# EasyEDA schematic Water Tank V6.1_2020-12-28_12-10-16.json

## Sheets
1 Reciver: TITLE: Reciver; REV: 1.0; Date: 2020-1-12; Sheet: 1/1; Drawn By: Arvind Anirudh; Company: Your Company
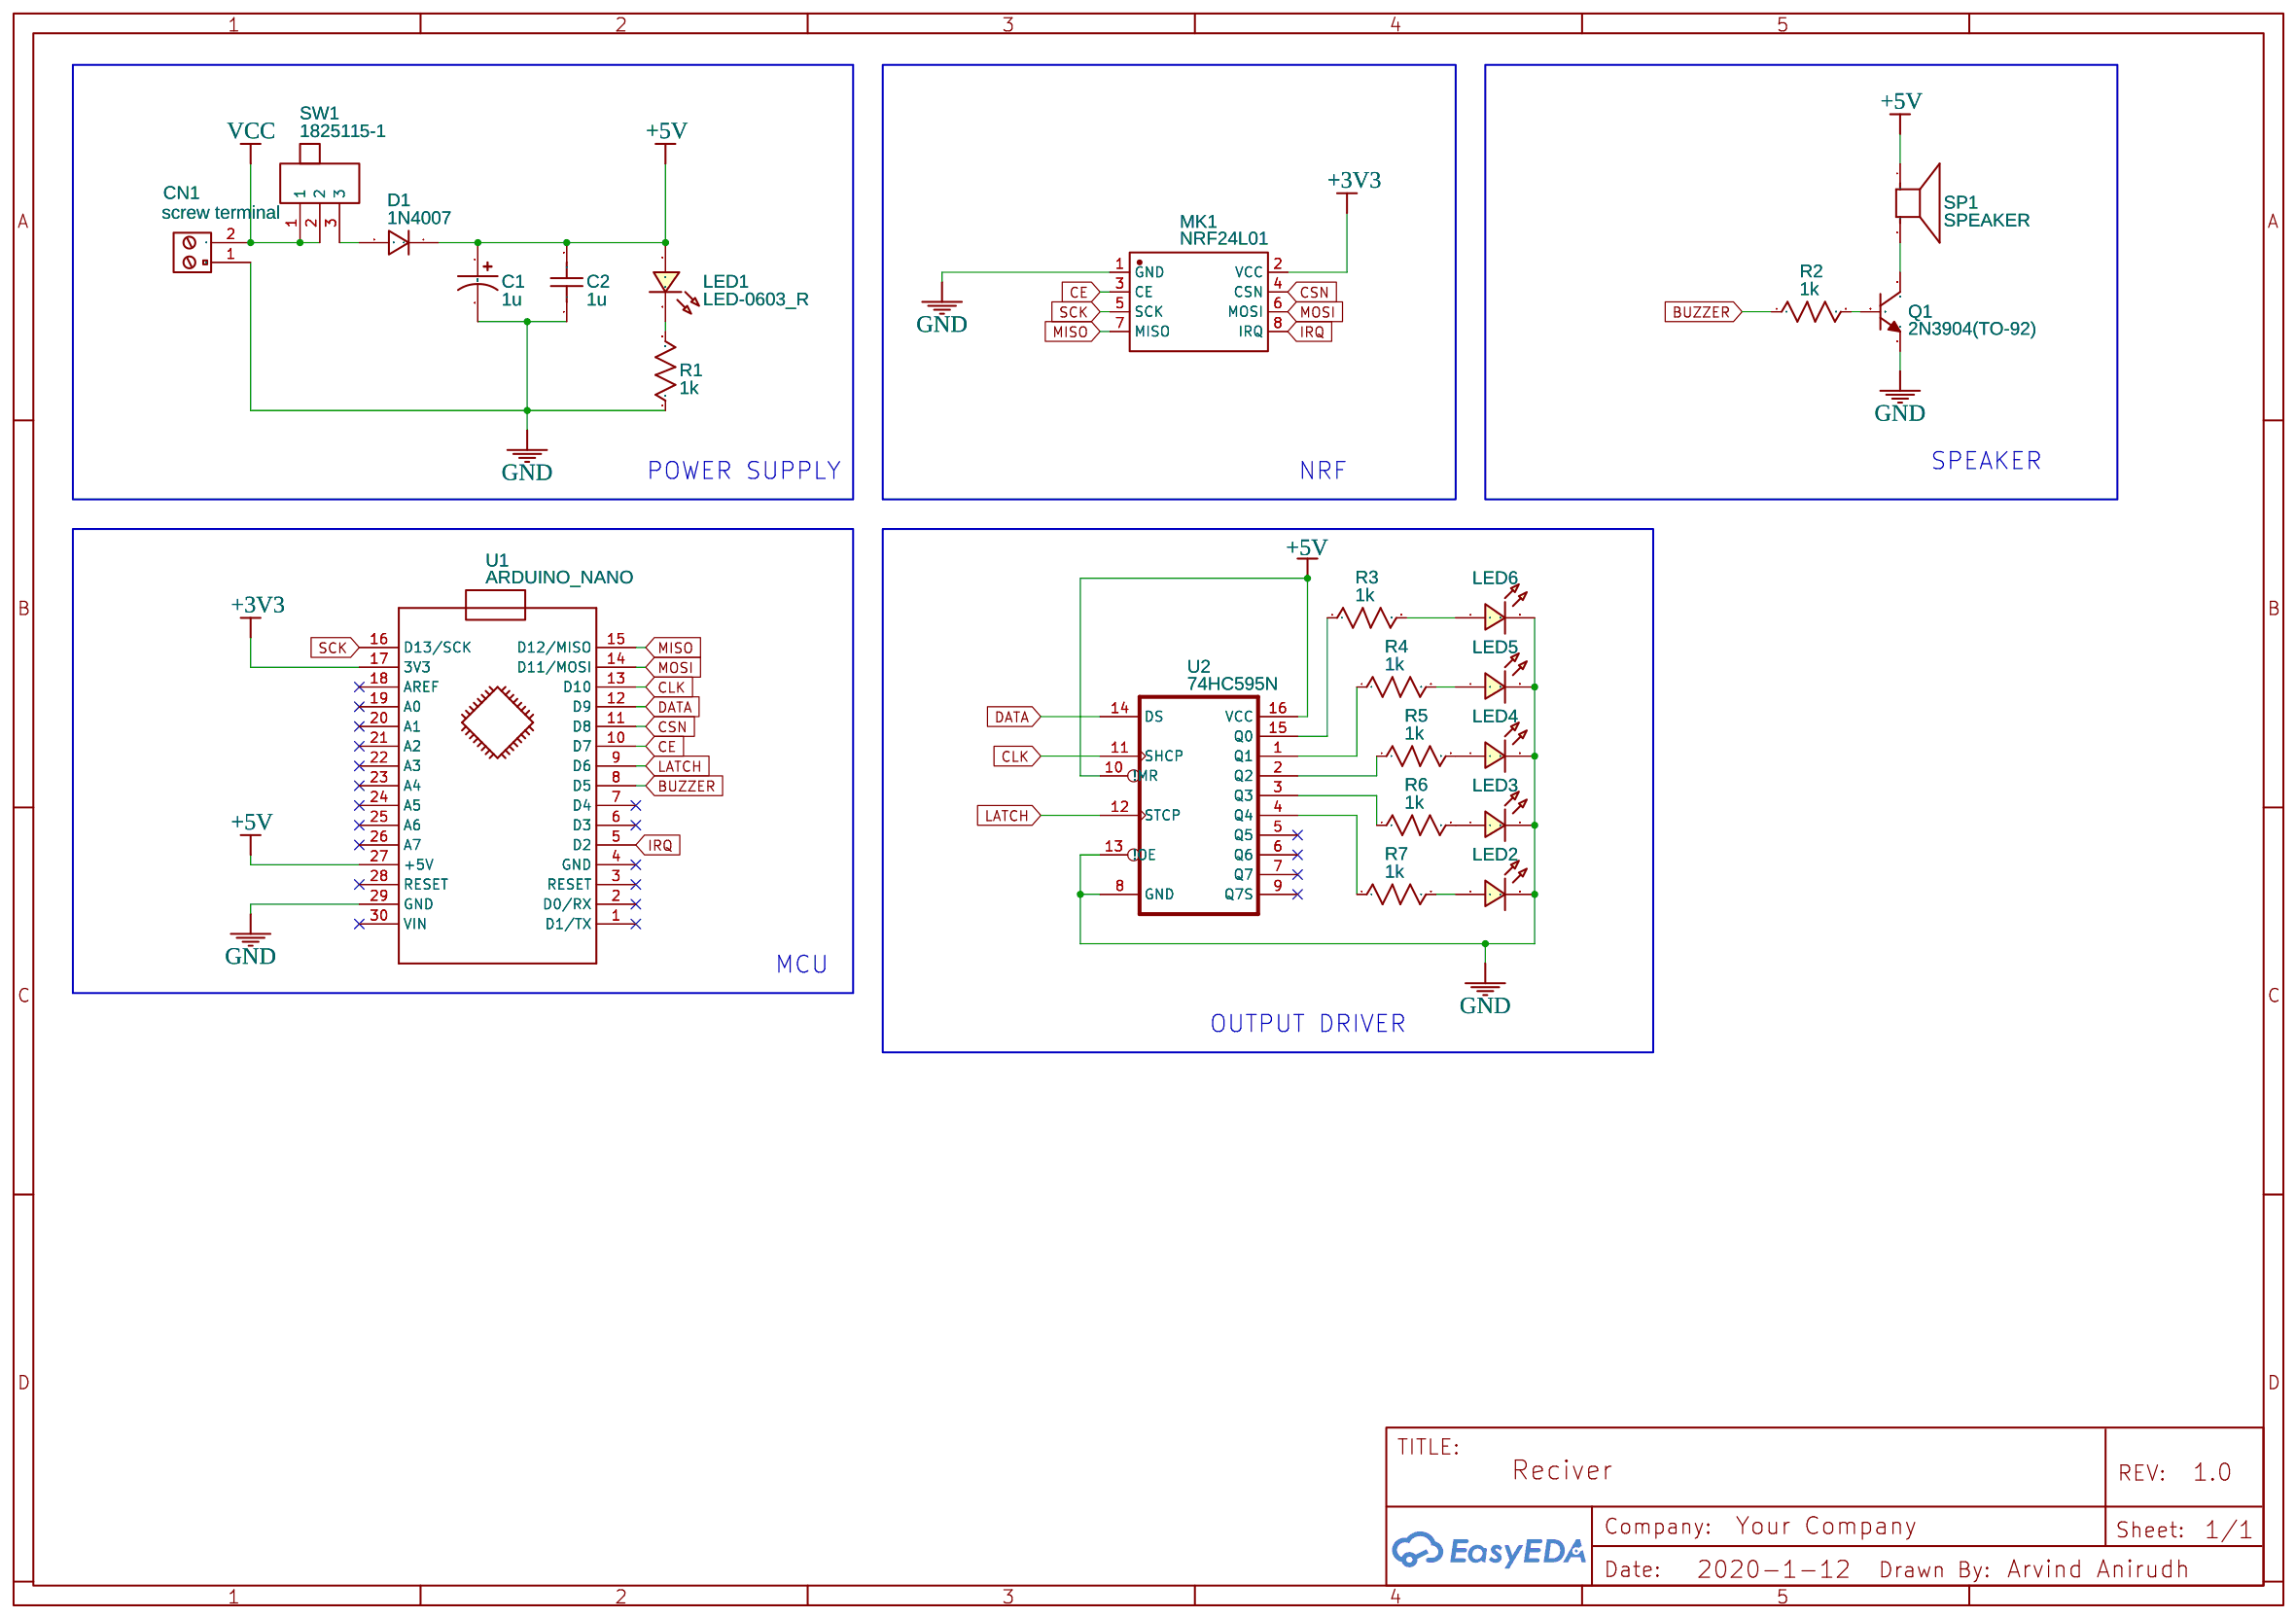
[diagram p0: Reciver]
2 Transmitter: TITLE: Transmitter
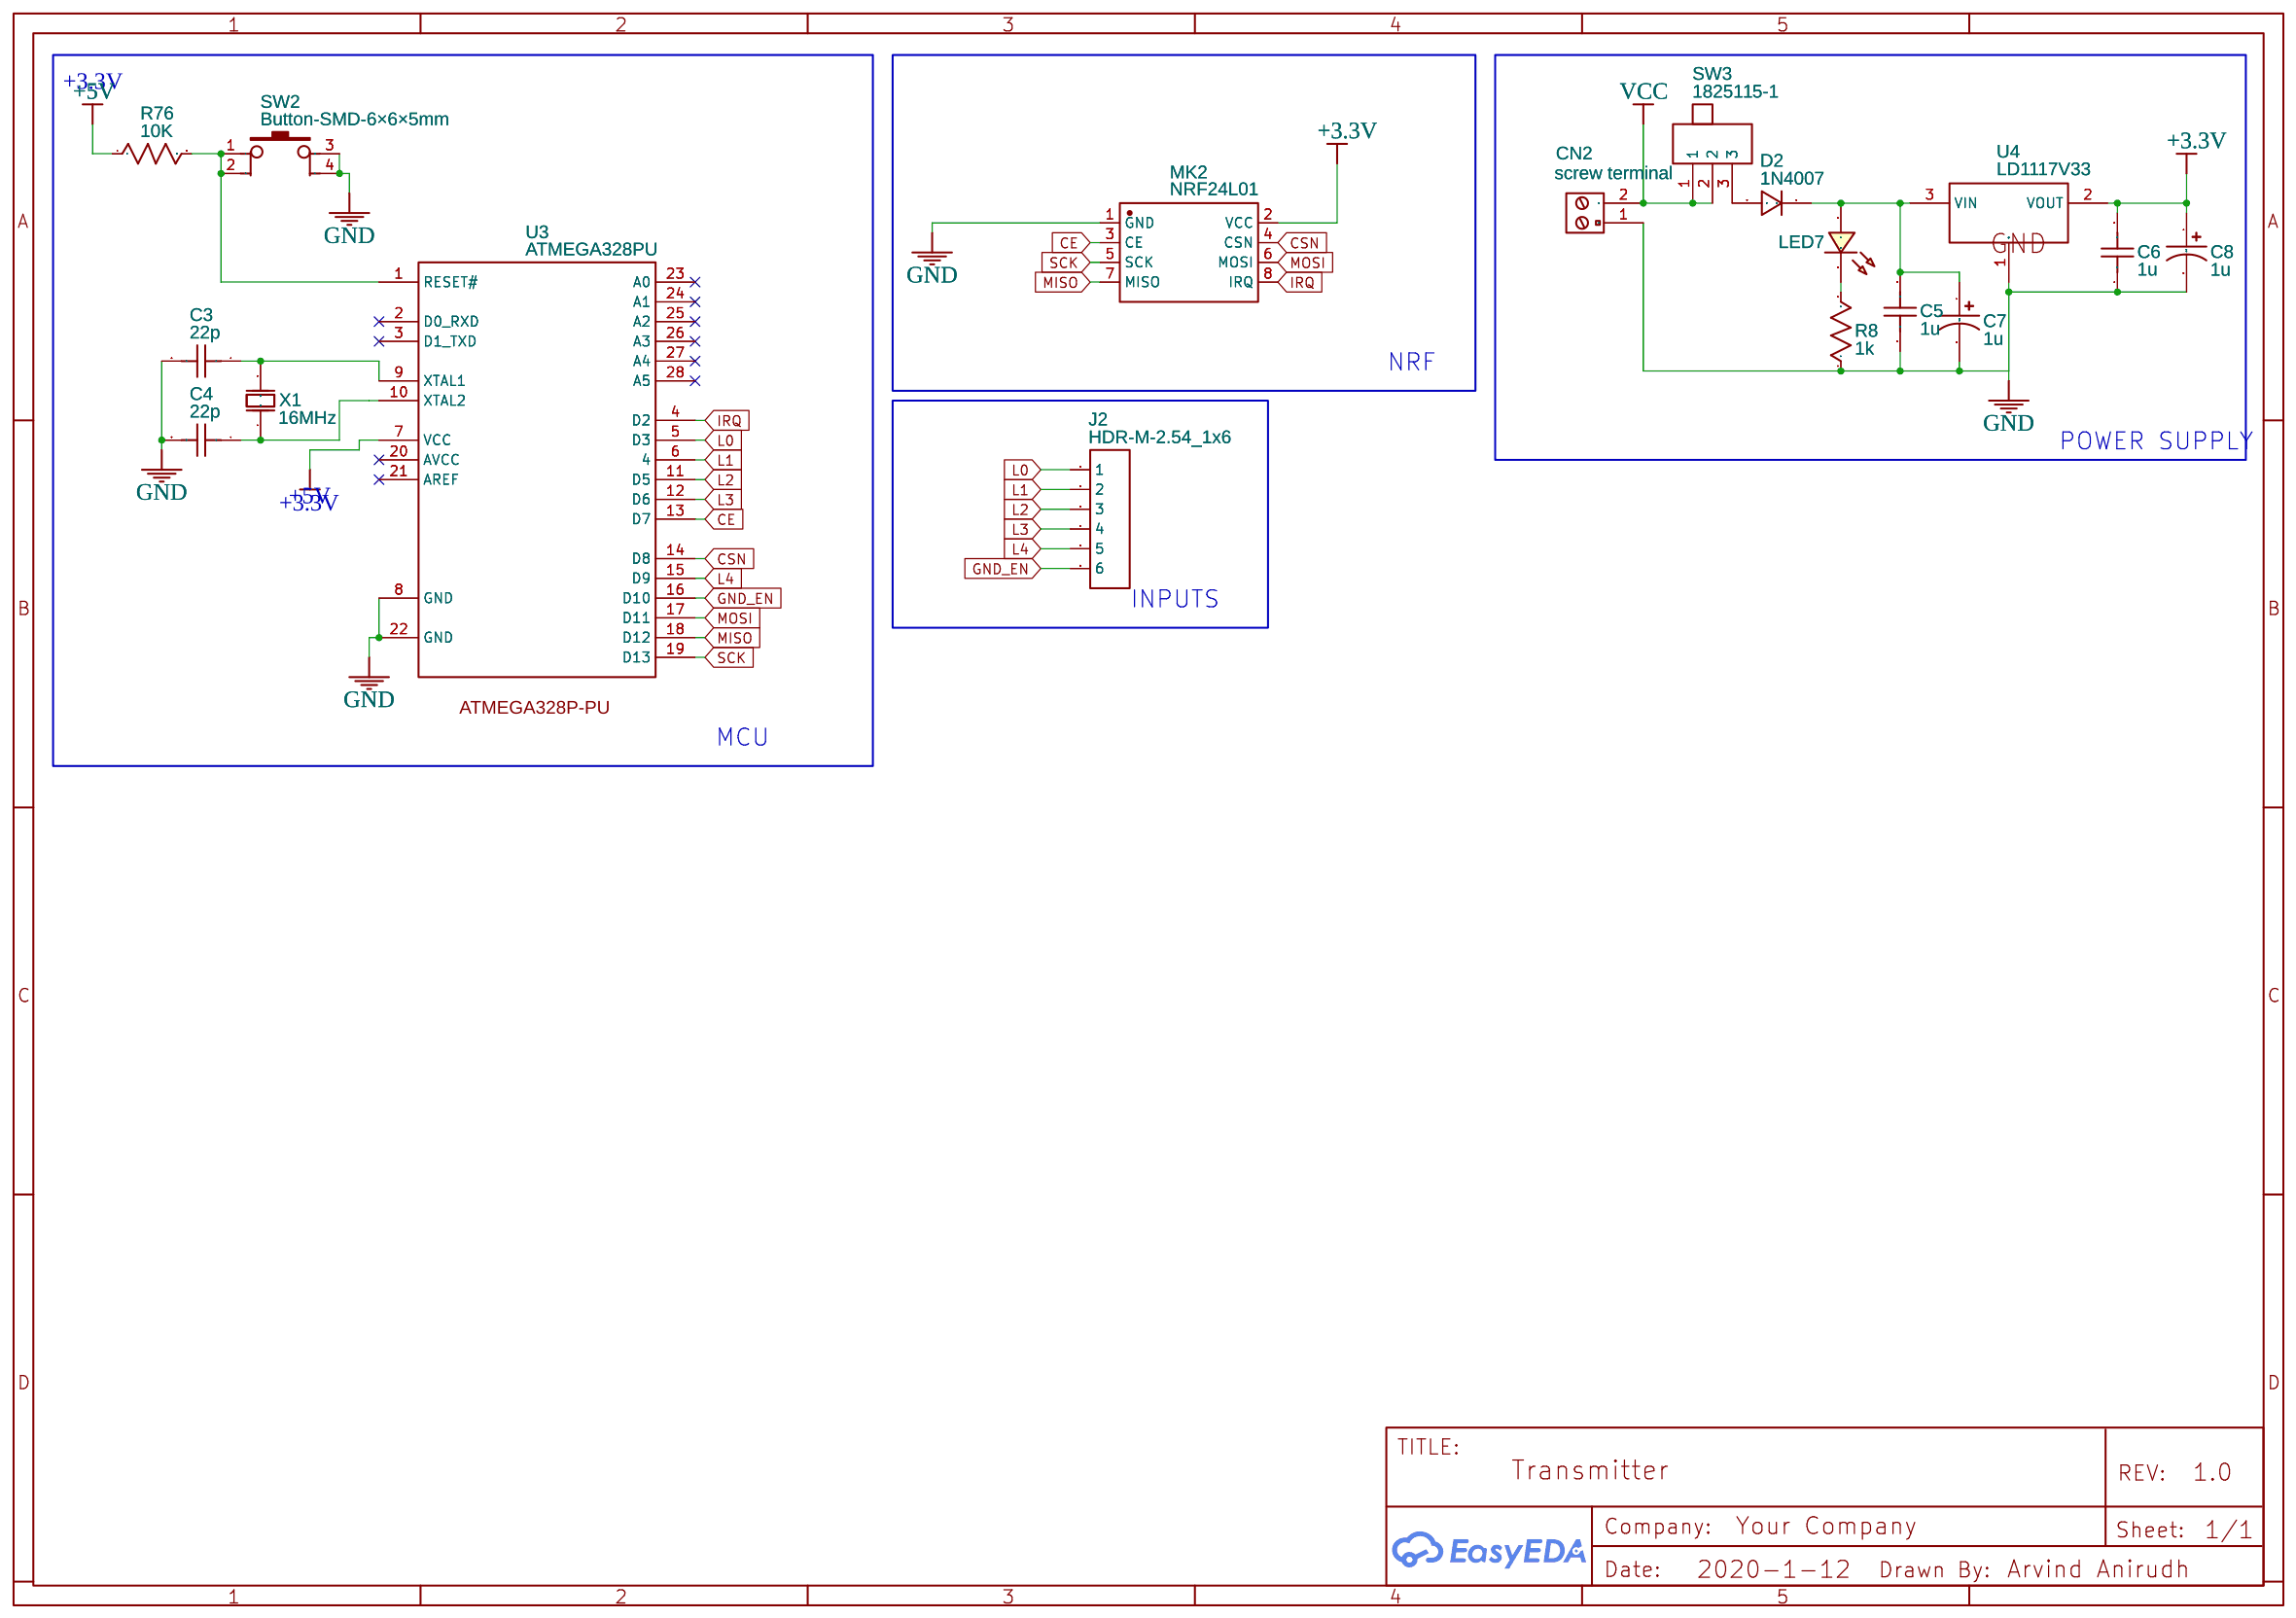
[diagram p1: Transmitter]

## Parts
sheet Reciver
C1  1u  [CAP-D4.0×F1.5]
C2  1u  [RAD-0.1]
CN1  screw terminal  [KF350-2P-3.5MM]
D1  1N4007  [DO-41_BD2.4-L4.7-P8.70-D0.9-RD]
LED1  LED-0603_R  [LED0603_RED]
LED2  LED-TH-3mm_R  [LED-TH_BD3.0_RED]
LED3  LED-TH-3mm_G  [LED-TH_BD3.0_GREEN]
LED4  LED-TH-3mm_G  [LED-TH_BD3.0_GREEN]
LED5  LED-TH-3mm_G  [LED-TH_BD3.0_GREEN]
LED6  LED-TH-3mm_B  [LED-TH_BD3.0_BLUE]
MK1  NRF24L01  [WIRELM-SMD_NRF24L01]
Q1  2N3904(TO-92)  [TO-92-3_L5.1-W4.1-P1.27-L]
R1  1k  [R_AXIAL-0.4]
R2  1k  [R_AXIAL-0.4]
R3  1k  [R_AXIAL-0.4]
R4  1k  [R_AXIAL-0.4]
R5  1k  [R_AXIAL-0.4]
R6  1k  [R_AXIAL-0.4]
R7  1k  [R_AXIAL-0.4]
SP1  SPEAKER  [AL60P]
SW1  1825115-1  [SW-TH_1825115-1]
U1  ARDUINO_NANO  [ARDUINO_NANO]
U2  74HC595N  [DIP16-2.54-20.32X5.84MM]
sheet Transmitter
C3  22p  [RAD-0.1]
C4  22p  [RAD-0.1]
C5  1u  [RAD-0.1]
C6  1u  [RAD-0.1]
C7  1u  [CAP-D4.0×F1.5]
C8  1u  [CAP-D4.0×F1.5]
CN2  screw terminal  [KF350-2P-3.5MM]
D2  1N4007  [DO-41_BD2.4-L4.7-P8.70-D0.9-RD]
J2  HDR-M-2.54_1x6  [HDR-M-2.54_1X6]
LED7  LED-0603_R  [LED0603_RED]
MK2  NRF24L01  [WIRELM-SMD_NRF24L01]
R8  1k  [R_AXIAL-0.4]
R76  10K  [0805]
SW2  Button-SMD-6×6×5mm  [SW-SMD_4PIN-L6.00-W6.00]
SW3  1825115-1  [SW-TH_1825115-1]
U3  ATMEGA328PU  [DIP-28_L34.6-W7.3-P2.54-LS10.2-BL]
U4  LD1117V33  [TO-220-3_L10.0-W4.5-P2.54-L]
X1  16MHz  [HC-49US_L11.5-W4.5-P4.88]

## Library data of the parts
C1 C7 C8 = CE_TH_D4.0×F1.5_US: Contributor: LCEDA_Lib
C2-C6 = C_RAD-0.1_US: Contributor: LCEDA_Lib
CN1 CN2 = KF350-2P 3.5mm screw terminal: Supplier: aliexpress; Supplier Part: KF350-2P; link: https://www.aliexpress.com/item/32835683328.html; Contributor: fbeer57
D1 D2 = 1N4007: Supplier: LCSC; Manufacturer: SEMTECH; Supplier Part: C106903; Contributor: LCEDA_Lib
LED1 LED7 = LED-0603_R: Manufacturer: EVERLIGHT(台湾亿光); Manufacturer Part: 19-217/R6C-AL1M2VY/3T; Supplier Part: C72044; Supplier: LCSC; Contributor: LCEDA_01
LED2 = LED-TH-3mm_R: Manufacturer: EVERLIGHT(台湾亿光); Manufacturer Part: 204-10SDRD/S530-A3-L; Supplier Part: C84774; Supplier: LCSC; Contributor: LCEDA_Lib
LED3-LED5 = LED-TH-3mm_G: Manufacturer: EVERLIGHT(台湾亿光); Manufacturer Part: 204-10SYGD/S530-E3; Supplier Part: C85161; Contributor: LCEDA_Lib
LED6 = LED-TH-3mm_B: Manufacturer: EVERLIGHT(台湾亿光); Manufacturer Part: 204-10SUBC/S400-A4; Supplier Part: C86881; Supplier: LCSC; Contributor: LCEDA_Lib
MK1 MK2 = NRF24L01: Supplier: LCSC; Manufacturer: Ai-Thinker; Manufacturer Part: NRF24L01+功率加强版绑定2.4Gwireless module; Supplier Part: C90751
Q1 = 2N3904(TO-92): Supplier: LCSC; Manufacturer: SEMTECH; Manufacturer Part: 2N3904; Supplier Part: C118538; Contributor: LCEDA_Lib
R1-R8 = R_AXIAL-0.4_US: Contributor: LCEDA_Lib
SP1 = SPEAKER: Contributor: Adafruit
SW1 SW3 = 1825115-1: Supplier: LCSC; Supplier Part: C266201; Manufacturer: TE Connectivity; Contributor: LCSC
U1 = ARDUINO_NANO: sourceId: KGSeAWhDB
U2 = 74HC595N: DIP IC Logic;
J2 = HDR-M-2.54_1x6: Supplier Part: C190819; Supplier: LCSC; Contributor: LCEDA_Lib
R76 = Res_0805(1/8W)_US
SW2 = Button-SMD-6×6×5mm: Supplier: LCSC; Manufacturer: ReliaPro; Manufacturer Part: 6×6×5mm RHOS; image: //image.lceda.cn/szlcsc/C21456.jpg; Supplier Part: C21456
U3 = ATMEGA328PU: Manufacturer: Microchip Tech; Manufacturer Part: ATMEGA328P-PU; Supplier: LCSC; Supplier Part: C33901; link: https://datasheet.lcsc.com/szlcsc/1811121616_Microchip-Tech-ATMEGA328P-PU_C33901.pdf; Contributor: W,Manoj Nishshanka Dias
U4 = LD1117V33: Supplier: LCSC; Supplier Part: C283467; Manufacturer: STMicroelectronics; Contributor: LCSC
X1 = X49SD16MSB2SI: Supplier: LCSC; Supplier Part: C188202; Manufacturer: Yangxing Tech; Contributor: LCSC

## Nets
+3.3V: C6.2 C8.1 MK2.2(VCC) U4.2(VOUT)
+3V3: MK1.2(VCC) U1.17(3V3)
+5V: C1.1 C2.2 D1.1 LED1.1 R76.1 SP1.1(+) U1.27(+5V) U2.10(!MR) U2.16(VCC) U3.7(VCC)
GND: C1.2 C2.1 C3.2 C4.2 C5.1 C6.1 C7.2 C8.2 CN1.1 CN2.1 LED2.2 LED3.2 LED4.2 LED5.2 LED6.2 MK1.1(GND) MK2.1(GND) Q1.1(E) R1.1 R8.1 SW2.3 SW2.4 U1.29(GND) U2.8(GND) U2.13(!OE) U3.8(GND) U3.22(GND) U4.1(GND)
GND_EN: J2.6 U3.16(D10)
VCC: CN1.2 CN2.2 SW1.1 SW1.2 SW3.1 SW3.2
BUZZER: R2.1 U1.8(D5)
CE: MK1.3(CE) MK2.3(CE) U1.10(D7) U3.13(D7)
CLK: U1.13(D10) U2.11(SHCP)
CSN: MK1.4(CSN) MK2.4(CSN) U1.11(D8) U3.14(D8)
DATA: U1.12(D9) U2.14(DS)
IRQ: MK1.8(IRQ) MK2.8(IRQ) U1.5(D2) U3.4(D2)
L0: J2.1 U3.5(D3)
L1: J2.2 U3.6(4)
L2: J2.3 U3.11(D5)
L3: J2.4 U3.12(D6)
L4: J2.5 U3.15(D9)
LATCH: U1.9(D6) U2.12(STCP)
MISO: MK1.7(MISO) MK2.7(MISO) U1.15(D12/MISO) U3.18(D12)
MOSI: MK1.6(MOSI) MK2.6(MOSI) U1.14(D11/MOSI) U3.17(D11)
SCK: MK1.5(SCK) MK2.5(SCK) U1.16(D13/SCK) U3.19(D13)
Net-(C3-1): C3.1 U3.9(XTAL1) X1.2(OSC2)
Net-(C4-1): C4.1 U3.10(XTAL2) X1.1(OSC1)
Net-(C5-2): C5.2 C7.1 D2.1 LED7.1 U4.3(VIN)
Net-(D1-2): D1.2 SW1.3
Net-(D2-2): D2.2 SW3.3
Net-(LED1-2): LED1.2 R1.2
Net-(LED2-1): LED2.1 R7.2
Net-(LED3-1): LED3.1 R6.2
Net-(LED4-1): LED4.1 R5.2
Net-(LED5-1): LED5.1 R4.2
Net-(LED6-1): LED6.1 R3.2
Net-(LED7-2): LED7.2 R8.2
Net-(Q1-2): Q1.2(B) R2.2
Net-(Q1-3): Q1.3(C) SP1.2(-)
Net-(R3-1): R3.1 U2.15(Q0)
Net-(R4-1): R4.1 U2.1(Q1)
Net-(R5-1): R5.1 U2.2(Q2)
Net-(R6-1): R6.1 U2.3(Q3)
Net-(R7-1): R7.1 U2.4(Q4)
Net-(R76-2): R76.2 SW2.1 SW2.2 U3.1(RESET#)

Not connected (* = marked no-connect by the designer): U1 1(D1/TX)* 2(D0/RX)* 3(RESET)* 4(GND)* 6(D3)* 7(D4)* 18(AREF)* 19(A0)* 20(A1)* 21(A2)* 22(A3)* 23(A4)* 24(A5)* 25(A6)* 26(A7)* 28(RESET)* 30(VIN)*; U2 5(Q5)* 6(Q6)* 7(Q7)* 9(Q7S)*; U3 2(D0 RXD)* 3(D1 TXD)* 20(AVCC)* 21(AREF)* 23(A0)* 24(A1)* 25(A2)* 26(A3)* 27(A4)* 28(A5)*

## Notes on the sheets
sheet 1
- POWER SUPPLY
- NRF
- SPEAKER
- MCU
- OUTPUT DRIVER
sheet 2
- +3.3V
- NRF
- POWER SUPPLY
- +3.3V
- INPUTS
- MCU
